# EAGLE design daglig (EAGLE 9.6.2)
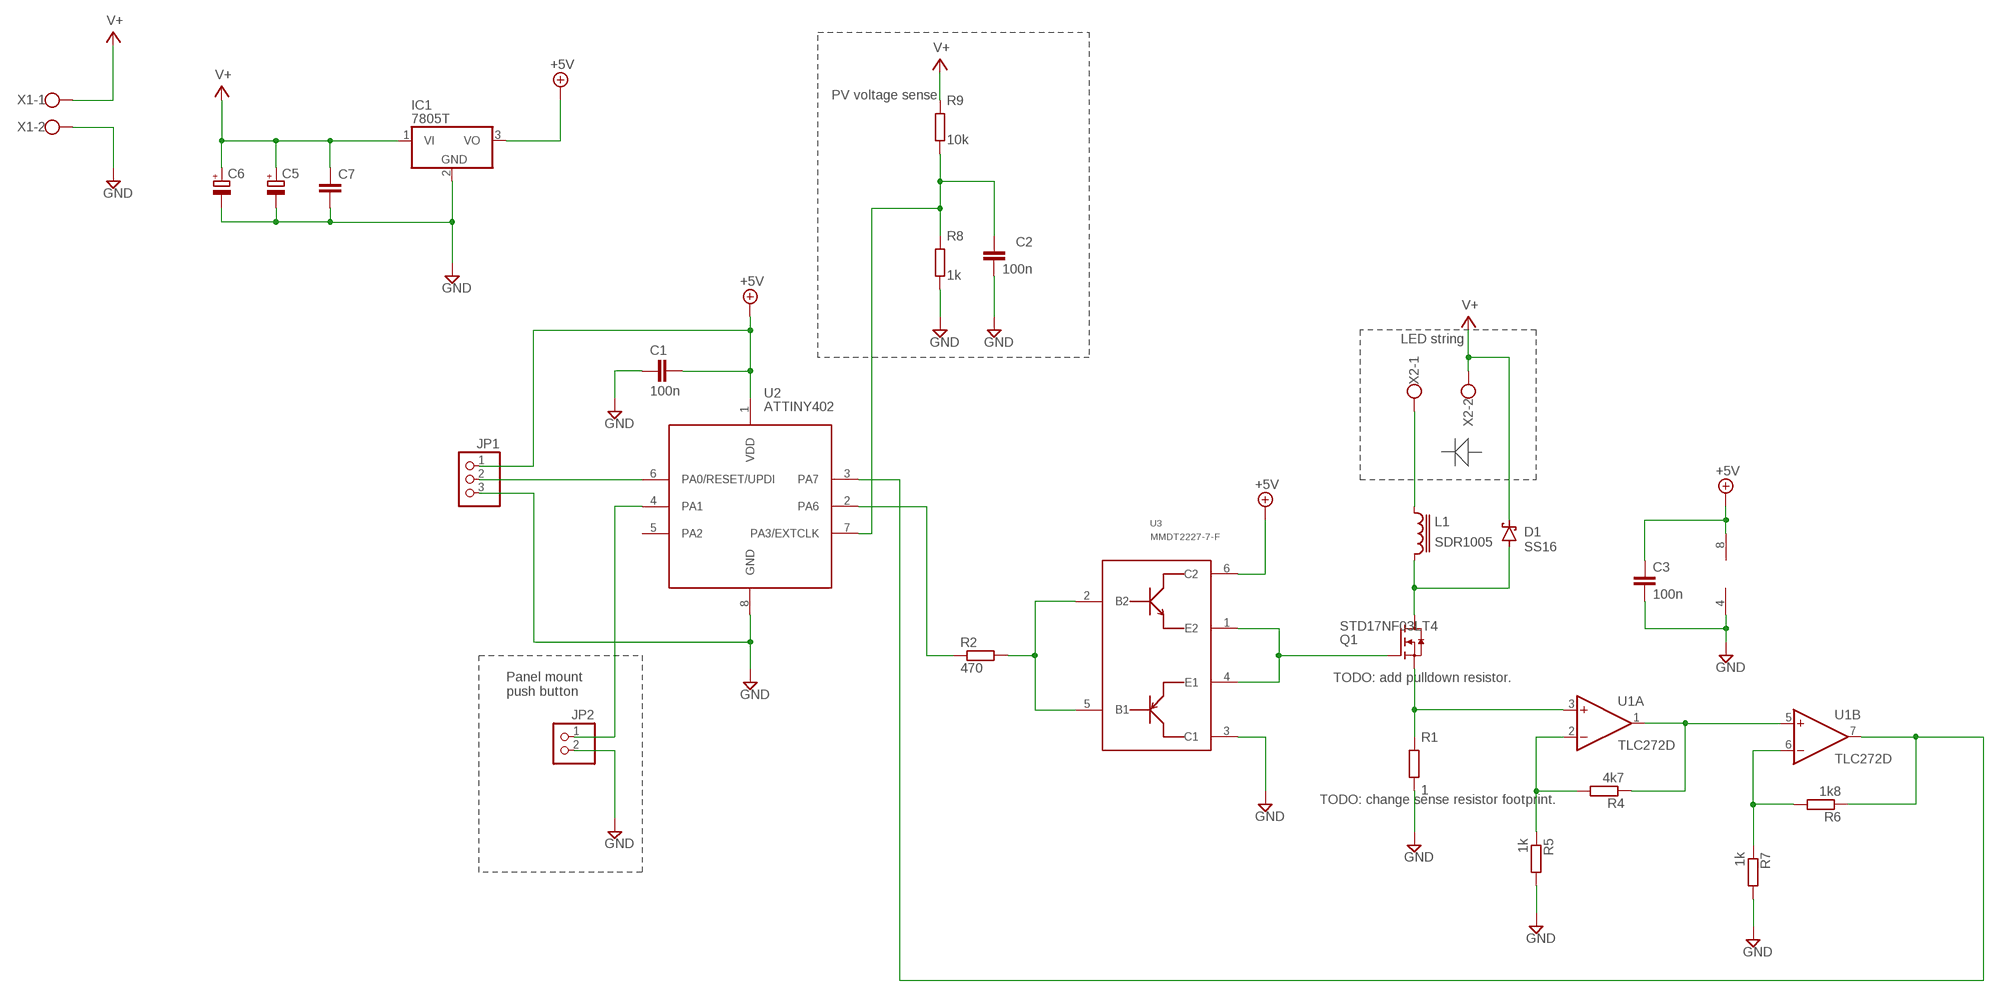
[diagram p0: schematic, sheet 1]

## Parts
C1  100n  C-EUC0805  [C0805]
C2  100n  C-EUC0805  [C0805]
C3  100n  C-EUC0805  [C0805]
C5  CPOL-EUE5-10.5  [E5-10,5]
C6  CPOL-EUE5-10.5  [E5-10,5]
C7  C-EUC0805  [C0805]
D1  SS16  [DO214AC]
IC1  7805T  [TO220H]
JP1  PINHD-1X3  [1X03]
JP2  PINHD-1X2  [1X02]
L1  SDR1005  [SDR1005]
Q1  STD17NF03LT4  [TO252]
R1  1  R-EU_R2512  [R2512]
R2  470  R-EU_R0805  [R0805]
R4  4k7  R-EU_R0805  [R0805]
R5  1k  R-EU_R0805  [R0805]
R6  1k8  R-EU_R0805  [R0805]
R7  1k  R-EU_R0805  [R0805]
R8  1k  R-EU_R0805  [R0805]
R9  10k  R-EU_R0805  [R0805]
U1  TLC272D  [SO08]
U2  ATTINY402  [SO8]
U3  MMDT2227-7-F  [SOT363_PHILIPS]
X1  W237-102  [W237-102]
X2  W237-102  [W237-102]

## Nets
+5V: C1.2 C3.1 IC1.3(VO) JP1.1 U1.8(P:V+) U2.1(VDD) U3.6(C2)
GND: C1.1 C2.2 C3.2 C5.- C6.- C7.2 IC1.2(GND) JP1.3 JP2.2 R1.1 R5.2 R7.2 R8.1 U1.4(P:V-) U2.8(GND) U3.3(C1) X1.2
N$1: Q1.1(G) U3.1(E2) U3.4(E1)
N$2: D1.A L1.2 Q1.3(D)
N$3: R2.2 U3.2(B2) U3.5(B1)
N$4: R2.1 U2.2(PA6)
N$5: Q1.2(S) R1.2 U1.3(A:+IN)
N$6: R4.1 U1.1(A:OUT) U1.5(B:+IN)
N$7: R6.1 U1.7(B:OUT) U2.3(PA7)
N$8: R6.2 R7.1 U1.6(B:-IN)
N$9: R4.2 R5.1 U1.2(A:-IN)
N$10: L1.1 X2.1
N$11: JP1.2 U2.6(PA0/RESET/UPDI)
N$13: C2.1 R8.2 R9.1 U2.7(PA3/EXTCLK)
N$14: JP2.1 U2.4(PA1)
V+: C5.+ C6.+ C7.1 D1.C IC1.1(VI) R9.2 X1.1 X2.2
Unconnected: U2.5(PA2)

## Notes on the sheet
- PV voltage sense
- LED string
- TODO: add pulldown resistor.
- Panel mount 
  push button
- TODO: change sense resistor footprint.

## Library data of the parts
C1-C3 C7 = rcl:C-EU: CAPACITOR, European symbol; SPICEPREFIX: C
C5 C6 = rcl:CPOL-EU: POLARIZED CAPACITOR, European symbol; SPICEPREFIX: C
D1 = myDiodes:SS16: SURFACE MOUNT SCHOTTKY BARRIER RECTIFIER SS16 Features For surface mounted applications. Metal-Semiconductor junction with gaurding. Epitaxial construction. Very low forward voltage drop. High current capability. Plastic material has UL flammability classification 94V-0. For use in low voltage, high frequency inverters, free wheeling, and polarity protection applications. Maximum Ratings Maximum Recurrent Peak Reverse Voltage: 60 V Maximum RMS Voltage: 42 V Maximum DC Blocking Voltage: 60 V Maximum Average Forward Rectified Current: 1.0 A Maximum Forward Voltage at 1.0 A: 0.70 V
IC1 = linear:78*: Positive VOLTAGE REGULATOR Source: http://cache.national.com/ds/LM/LM78L05.pdf http://www.fairchildsemi.com/ds/LM/LM7805.pdf
JP1 = pinhead:PINHD-1X3: PIN HEADER
JP2 = pinhead:PINHD-1X2: PIN HEADER
L1 = inductor-bourns:SDR1005: POWER INDUCTOR
Q1 = MOSFETs:STD17NF03LT4: N-channel 30V - 0.038Ω - 17A - DPAK/IPAK STripFET™ II Power MOSFET This Power MOSFET is the latest development of STMicroelectronics unique "Single Feature Size™" strip-based process. The resulting transistor shows extremely high packing density for low on-resistance, rugged avalanche characteristics and less critical alignment steps therefore a remarkable manufacturing reproducibility.
R1 R2 R4-R9 = rcl:R-EU_: RESISTOR, European symbol; SPICEPREFIX: R
U1 = linear:TLC272: OP AMP
U2 = ATtiny0Series:ATTINY402: The ATtiny202/402 microcontrollers are using the high-performance, low-power AVR� RISC architecture, and are capable of running at up to 20 MHz, with up to 2/4 KB Flash, 128/256 bytes of SRAM, and 64/128 bytes of EEPROM in a 8-pin package. The series uses the latest technologies with a flexible and low-power architecture including Event System and SleepWalking, accurate analog features, and advanced peripherals.
U3 = myTransistors:MMDT2227-7-F: COMPLEMENTARY NPN / PNP SMALL SIGNAL SURFACE MOUNT TRANSISTOR Complementary Pairs One 2222A Type (NPN)One 2907A Type (PNP)
X1 X2 = con-wago-500:W237-102: WAGO SCREW CLAMP; MPN: 237-102; OC_FARNELL: unknown; OC_NEWARK: 70K9898

## Board
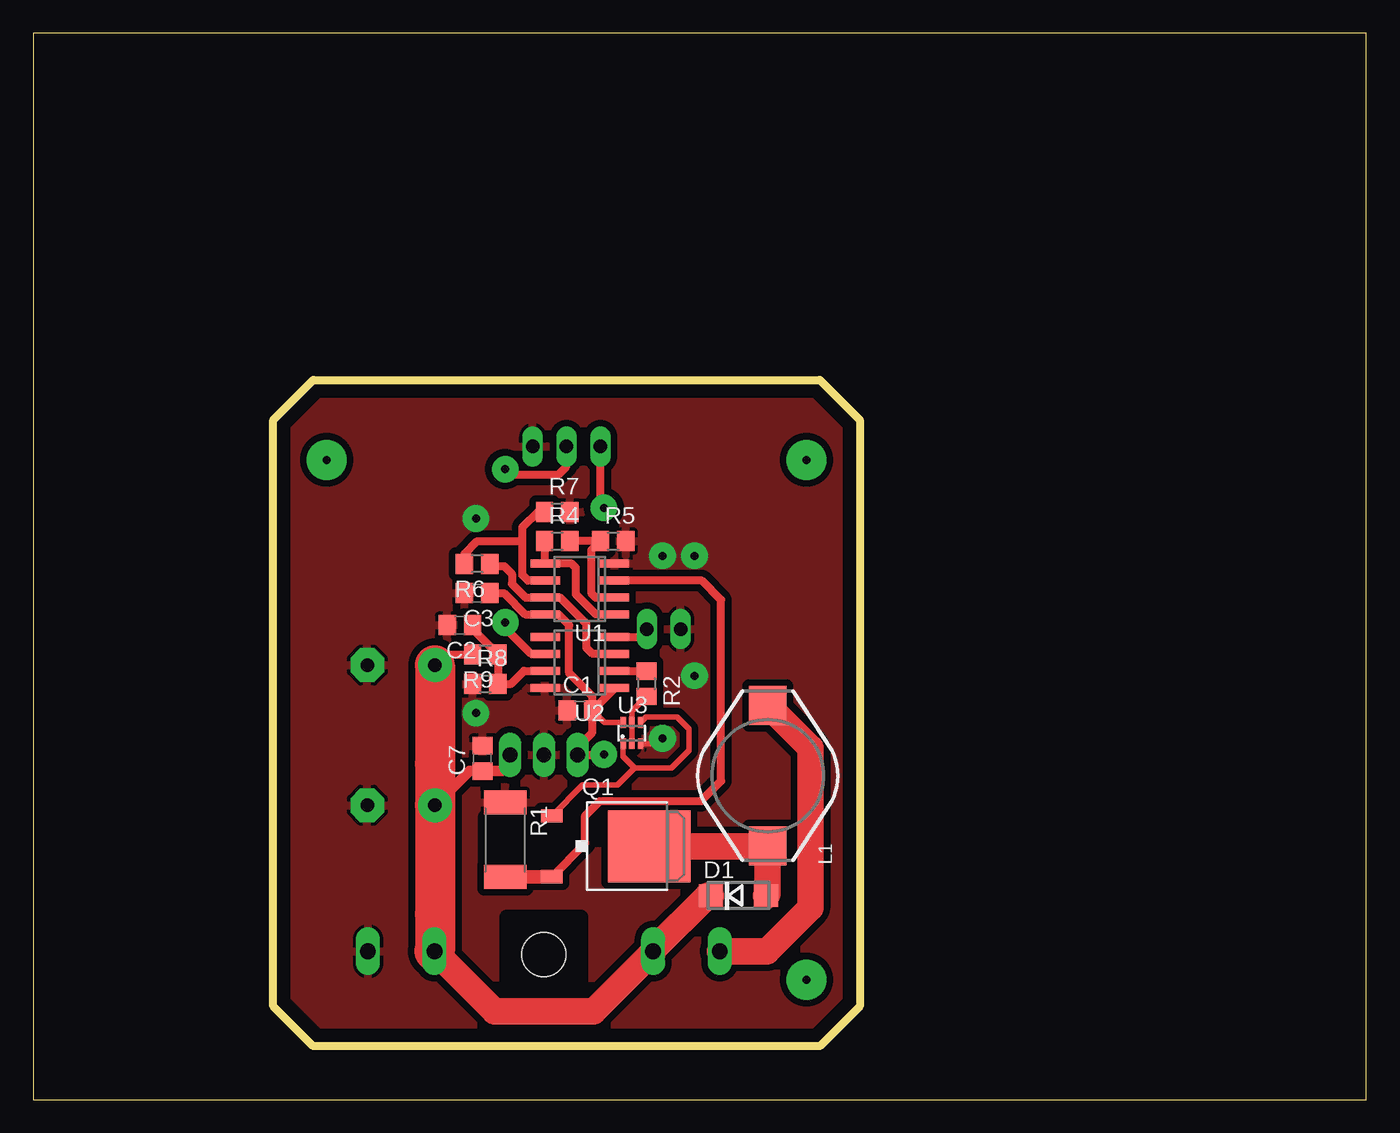
[diagram p1: board, top side]
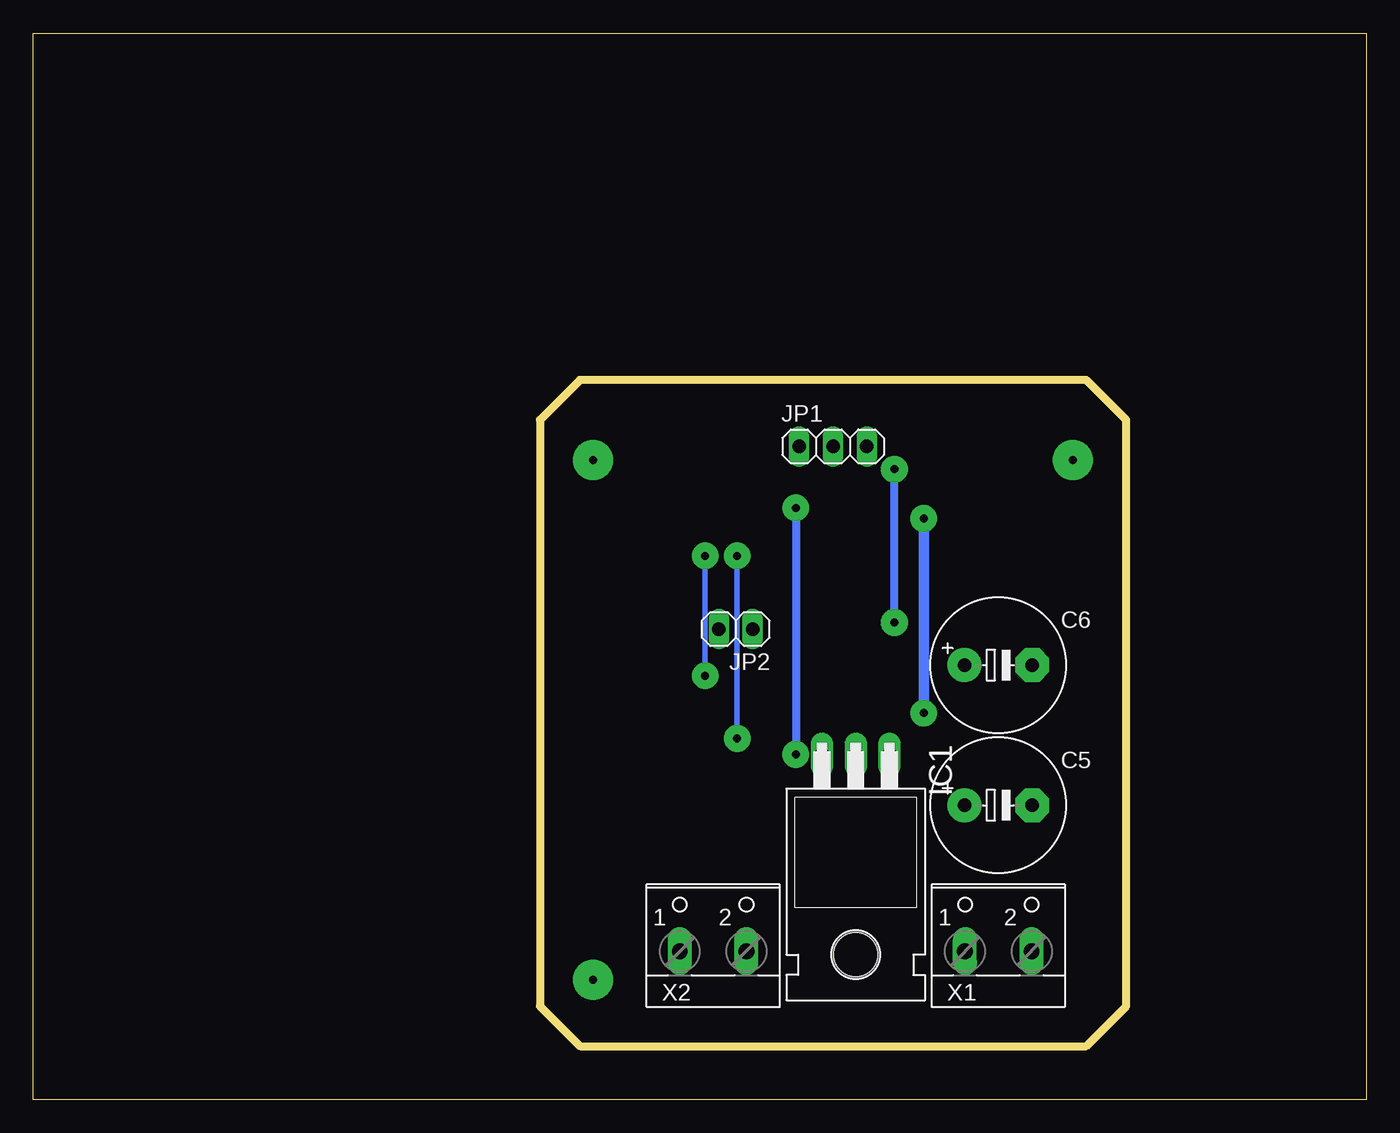
[diagram p2: board, bottom side, seen from below]

Size 100 x 80 mm. Coordinates in mm from the lower left corner, seen from the top.
Outline: 0,0 100,0 100,80 0,80 0,0
Outline: 18,7 18,51 21,54 59,54 62,51 62,7 59,4 21,4 18,7
Copper layers (1*16): Top 0.035mm / dielectric 1.5mm / Bottom 0.035mm
Design rules "default": minimum track width 6mil, minimum drill 0.35mm, track to track 6mil, track to pad 6mil, pad to pad 6mil, via to via 6mil, smd to smd 6mil, copper to edge 40mil, drill to drill 6mil, minimum pad ring 10mil, minimum via ring 8mil, stop-mask expansion 4mil, vias tented up to drill 0mil, thermal gap 10mil
tRestrict: 7 lines

### Footprints (pad centres in the part's own frame; a part is rotated, then mirrored left to right if it is on the bottom)
C0805 = smd 1.3 x 1.5: 1 -0.95,0; 2 0.95,0
E5-10,5 = drill 1.016 pad 2.54: + -2.54,0 | drill 1.016 pad 2.54 octagon: - 2.54,0
DO214AC = smd 1.8 x 1.7: A 2.05,0; C -2.05,0
TO220H = drill 1.118 long: 1 -2.54,-10.16; 2 0,-10.16; 3 2.54,-10.16 | hole 3.302: 0,4.826
1X03 = drill 1.016 long: 1 -2.54,0; 2 0,0; 3 2.54,0
1X02 = drill 1.016 long: 1 -1.27,0; 2 1.27,0
SDR1005 = smd 2.92 x 2.79: 1 -5.28,0; 2 5.28,0
TO252 = smd 1 x 1.6: 1 -2.28,-4.8; 2 2.28,-4.8 | smd 5.4 x 6.2: 3 0,2.5
R2512 = smd 1.8 x 3.2: 1 -2.8,0; 2 2.8,0
R0805 = smd 1.3 x 1.5: 1 -0.95,0; 2 0.95,0
SO08 = smd 0.6 x 2.2: 1 -1.905,-2.6; 2 -0.635,-2.6; 3 0.635,-2.6; 4 1.905,-2.6; 5 1.905,2.6; 6 0.635,2.6; 7 -0.635,2.6; 8 -1.905,2.6
SO8 = smd 0.6 x 2.2: 1 -1.905,-2.6; 2 -0.635,-2.6; 3 0.635,-2.6; 4 1.905,-2.6; 5 1.905,2.6; 6 0.635,2.6; 7 -0.635,2.6; 8 -1.905,2.6
SOT363_PHILIPS = smd 0.4 x 0.8: 1 -0.65,-0.8; 2 0,-0.8; 3 0.65,-0.8; 4 0.65,0.8; 5 0,0.8; 6 -0.65,0.8
W237-102 = drill 1.194 long: 1 -2.5,-1.27; 2 2.5,-1.27

### Placement (x,y rotation side)
C1  41,29.2 0 top
C2  32,35.6 180 top
C3  33.3,38 180 top
C5  27.6,22.08 0 bottom
C6  27.6,32.6 0 bottom
C7  33.7,25.6 90 top
D1  52.9,15.3 0 top
IC1  38.3,15.7 180 bottom
JP1  40,49 0 bottom
JP2  47.3,35.3 180 bottom
L1  55.1,24.3 270 top
Q1  43.7,19 270 top
R1  35.4,19.5 270 top
R2  46,31.2 270 top
R4  39.3,41.9 0 top
R5  43.5,41.9 0 top
R6  33.3,40.2 180 top
R7  39.3,44.1 0 top
R8  33.9,31.2 0 top
R9  33.9,33.4 180 top
U1  41,38.3 90 top
U2  41,32.8 90 top
U3  44.9,27.5 0 top
X1  27.6,12.4 0 bottom
X2  49,12.4 0 bottom

### Tracks (layer width: path | path; a pad name or v marks a point on that pad's centre or on a via)
+5V  (via drill 0.6 pad 2)
  Top 0.4: C1.2 42.85,28.3 U3.6
  Top 0.6: C1.2 43.6,30.85 U2.1 | C1.2 41.95,27.55 40.84,26.44 IC1.3 42.76,25.86 v42.8,25.9 | C1.2 41.95,30.25 40.2,32 40.2,35.6 39.41,36.4 U1.8 36.91,36.4 35.3,38 C3.1 | v42.8,44.4 42.54,44.66 JP1.1
  Bottom 0.6: v42.8,44.4 v42.8,25.9
GND  (via drill 0.6 pad 2)
  Top 0.4: 45.55,26.5 U3.3 46.8,26.7 v47.2,27.1
  Bottom 0.4: v47.2,40.8 v47.2,27.1 | v49.6,40.8 v49.6,31.8
  Bottom 0.8: v33.2,43.6 v33.2,29
  pour Top (isolate 0.5): 18,54 62,54 62,4 18,4
N$1
  Top 0.4: U3.1 44.25,25.75 45.12,24.88 | U3.4 45.95,28.7 48.3,28.7 49.2,27.8 49.2,26.2 47.88,24.88 45.12,24.88 | Q1.1 41.22,23.6 43.84,23.6 45.12,24.88
N$2
  Top 2: Q1.3 55.08,19 | 55.08,19 L1.2 | D1.A 55.08,15.43 55.08,19
N$3
  Top 0.4: R2.2 44.9,29.15 U3.5 U3.2
N$4
  Top 0.6: U2.2 45.98,32.16 R2.1
N$5
  Top 0.6: Q1.2 41.4,19.22 41.4,21.3 42.5,22.4 50.1,22.4 51.6,23.9 51.6,37.5 50.16,38.94 U1.3
  Top 1: R1.2 38.88,16.7 Q1.2
N$6
  Top 0.4: R4.1 38.08,41.62
  Top 0.6: U1.1 42.91,36.4 42.9,36.4 42.2,36.4 40.7,37.9 40.7,39.9 40.4,40.2 U1.5 38.35,40.26 R4.1
N$7
  Top 0.6: U2.3 41.97,33.44 41.5,33.9 41.5,35.7 39.53,37.66 U1.7 36.94,37.66 35.9,38.7 35.9,39.45 35.35,40 34.45,40 R6.1
N$8
  Top 0.6: U1.6 37.12,38.94 36.7,39.35 36.7,41.9 | R7.1 37.85,44.1 36.7,42.95 36.7,41.9 | R6.2 32.35,40.95 33.3,41.9 36.7,41.9
N$9
  Top 0.6: U1.2 42.2,37.66 41.85,38.01 41.85,41.2 R5.1 R4.2
N$10
  Top 2: L1.1 58.3,26.38 58.3,14.4 55.03,11.13 X2.1
N$11  (via drill 0.6 pad 2)
  Top 0.6: U2.6 37.35,33.44 35.4,35.39 v35.4,35.8 | v35.4,47.3 35.8,46.9 39.4,46.9 40,47.5 JP1.2
  Bottom 0.6: v35.4,35.8 v35.4,47.3
N$12  (via drill 0.6 pad 3)
  other vias: 58,48
N$13
  Top 0.6: U2.7 36.81,32.16 35.85,31.2 R8.2 R9.1 32.95,35.3 C2.1
N$14
  Top 0.6: U2.4 45.44,34.7 JP2.1
N$15  (via drill 0.6 pad 3)
  other vias: 22,48
N$16  (via drill 0.6 pad 3)
  other vias: 58,9
V+
  Top 0.6: C6.+ 30.94,33.4 R9.2
  Top 0.8: 30.79,25.85 30.14,25.2 | IC1.1 35.76,25.26 35.15,24.65 C7.1 32.71,24.65 C5.+
  Top 1: 30.44,14.2 30.14,13.9
  Top 2: D1.C 50.57,15.3 46.5,11.23 X2.2 46.5,11.09 42.02,6.61 34.62,6.61 X1.1
  Top 3: C6.+ 30.14,25.2 C5.+ 30.14,13.9 30.14,11.17 X1.1